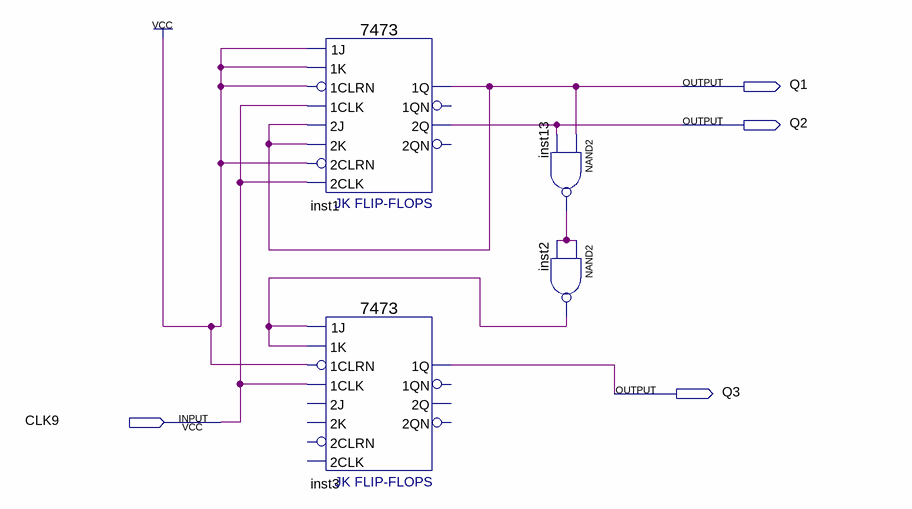
[diagram p0: schematic sheet]
// Quartus schematic project3.bdf as structural Verilog: 4 symbols, 4 pins
module project3 (
  input  CLK9,
  output Q1,
  output Q2,
  output Q3
);

  wire inst2_out, inst13_out;

  \7473  inst1 (
    .\1J (1'b1), .\1CLRN (1'b1), .\1K (1'b1), .\1CLK (CLK9), .\2J (Q1), .\2CLK (CLK9), .\2CLRN (1'b1),
    .\2K (Q1), .\2Q (Q2), .\1Q (Q1));  // open: 1QN, 2QN
  \7473  inst3 (
    .\1J (inst2_out), .\1CLRN (1'b1), .\1K (inst2_out), .\1CLK (CLK9), .\1Q (Q3));  // open: 2J, 2CLK, 2CLRN, 2K, 1QN, 2Q, 2QN
  nand inst13 (inst13_out, Q1, Q2);
  nand inst2 (inst2_out, inst13_out, inst13_out);
endmodule
